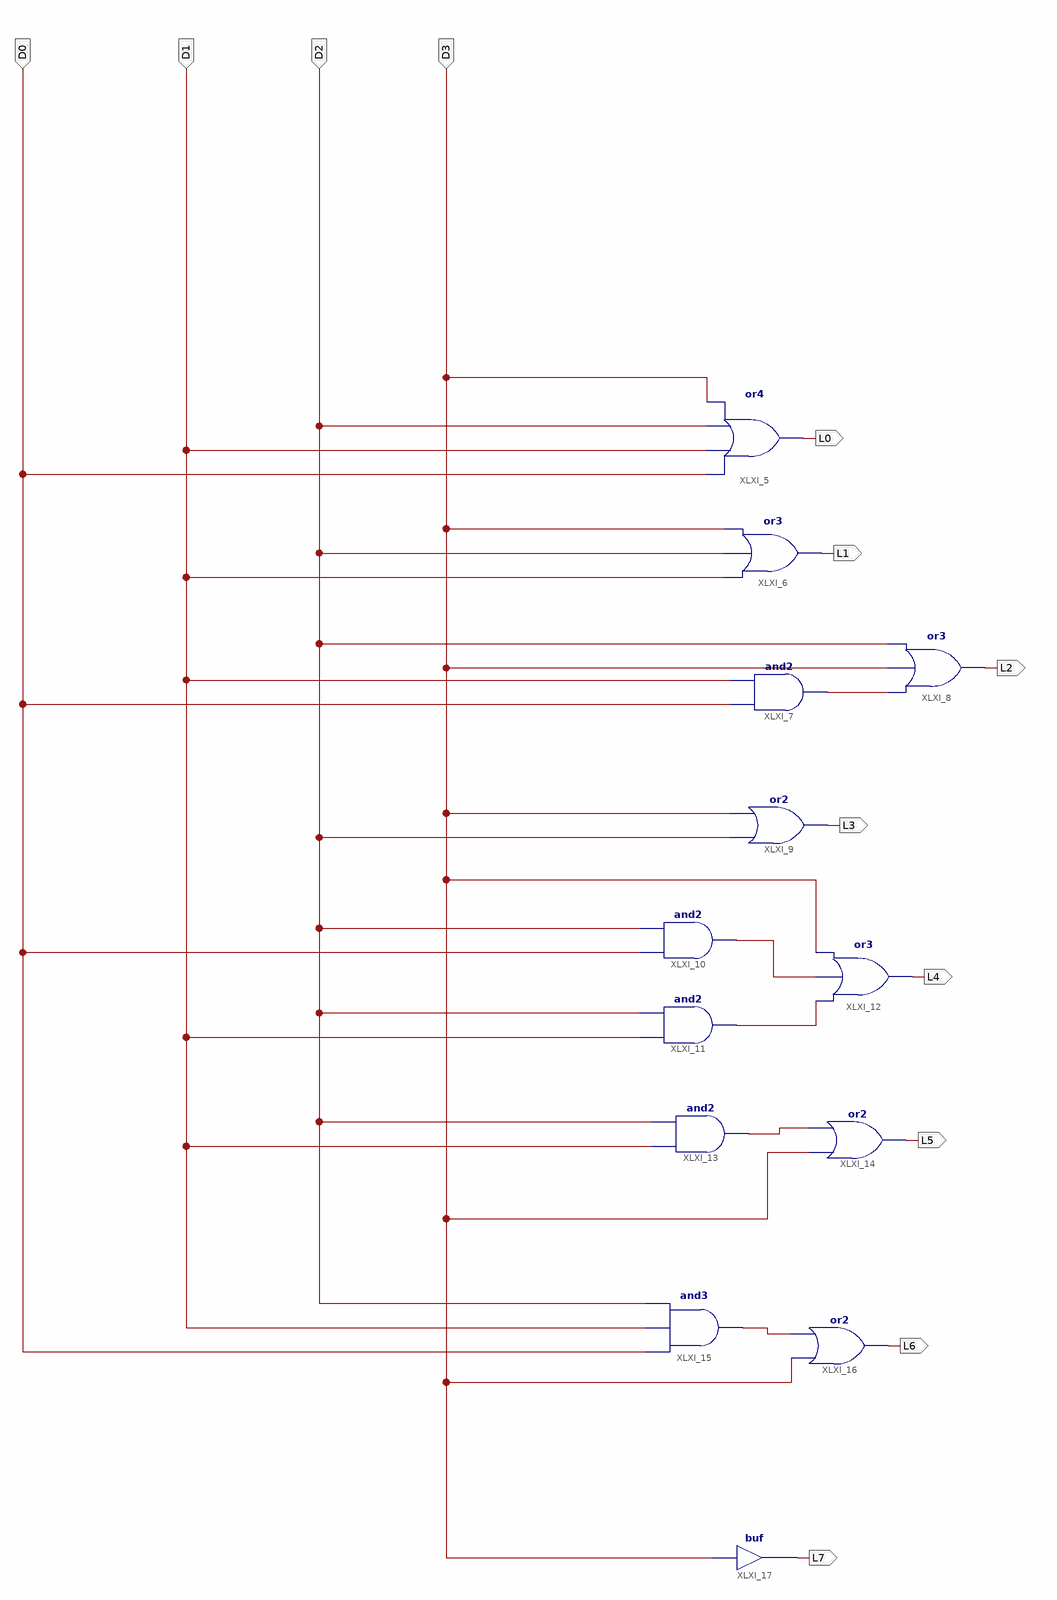
[diagram p0: schematic sheet 1]
// Xilinx ISE schematic Lab9_4bitTo8led.sch (spartan6) as structural Verilog: 13 symbols, 12 ports
module Lab9_4bitTo8led (
  input  D0,
  input  D1,
  input  D2,
  input  D3,
  output L0,
  output L1,
  output L2,
  output L3,
  output L4,
  output L5,
  output L6,
  output L7
);

  wire XLXN_24, XLXN_35, XLXN_36, XLXN_39, XLXN_44;

  or XLXI_5 (L0, D0, D1, D2, D3);
  or XLXI_6 (L1, D1, D2, D3);
  and XLXI_7 (XLXN_24, D0, D1);
  or XLXI_8 (L2, XLXN_24, D3, D2);
  or XLXI_9 (L3, D2, D3);
  and XLXI_10 (XLXN_35, D0, D2);
  and XLXI_11 (XLXN_36, D1, D2);
  or XLXI_12 (L4, XLXN_36, XLXN_35, D3);
  and XLXI_13 (XLXN_39, D1, D2);
  or XLXI_14 (L5, D3, XLXN_39);
  and XLXI_15 (XLXN_44, D0, D1, D2);
  or XLXI_16 (L6, D3, XLXN_44);
  buf XLXI_17 (L7, D3);
endmodule
